# EAGLE design M710H (EAGLE 6.6.0)
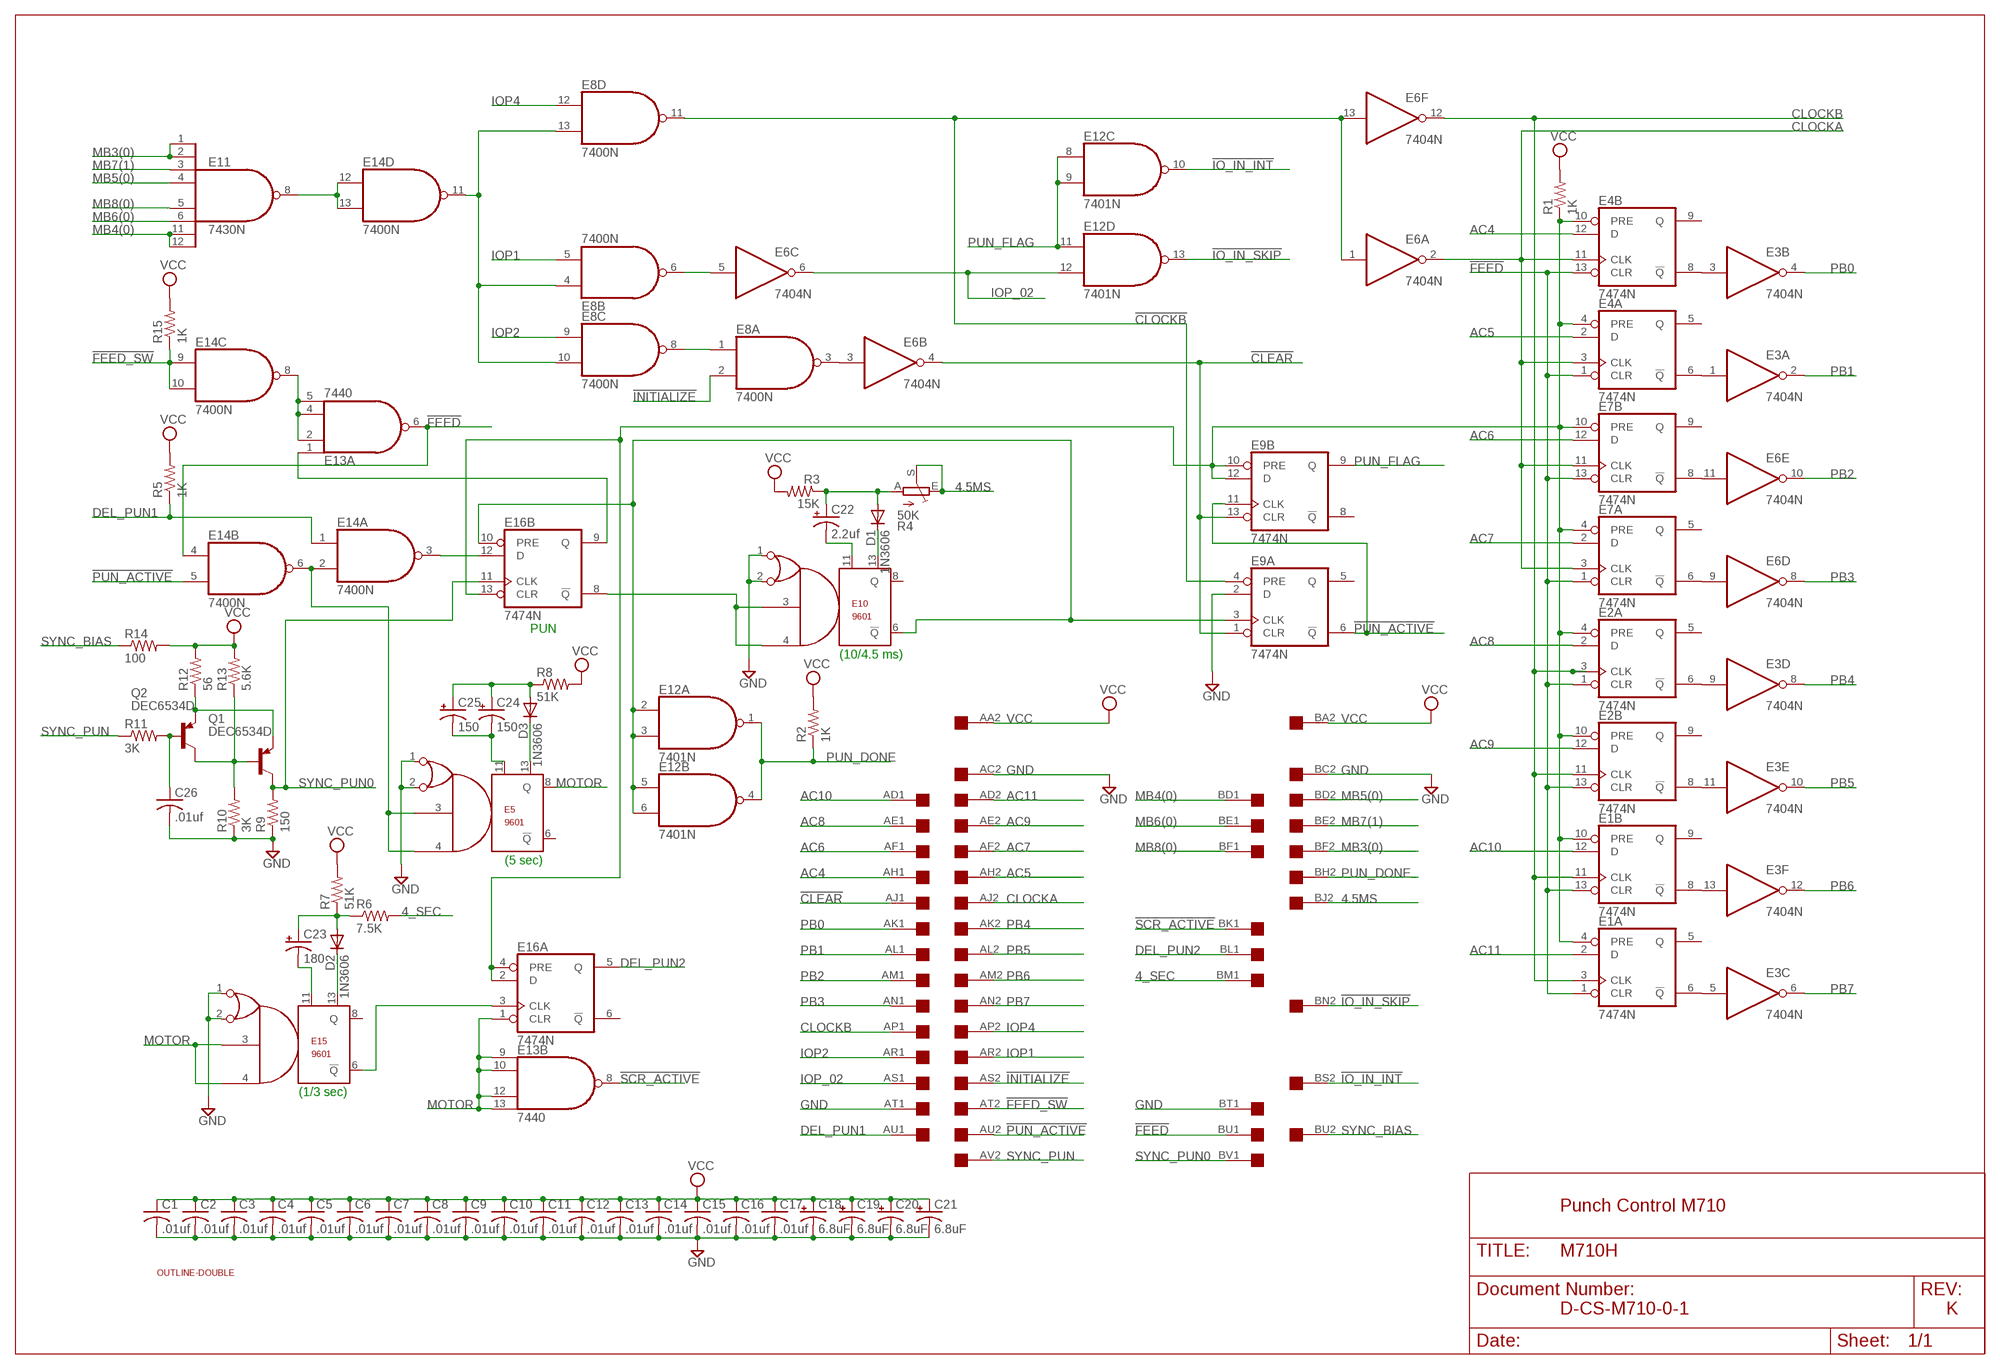
[diagram p0: schematic, sheet 1]

## Parts
C1  .01uf  C-US050-025X075  [C050-025X075]
C2  .01uf  C-US050-025X075  [C050-025X075]
C3  .01uf  C-US050-025X075  [C050-025X075]
C4  .01uf  C-US050-025X075  [C050-025X075]
C5  .01uf  C-US050-025X075  [C050-025X075]
C6  .01uf  C-US050-025X075  [C050-025X075]
C7  .01uf  C-US050-025X075  [C050-025X075]
C8  .01uf  C-US050-025X075  [C050-025X075]
C9  .01uf  C-US050-025X075  [C050-025X075]
C10  .01uf  C-US050-025X075  [C050-025X075]
C11  .01uf  C-US050-025X075  [C050-025X075]
C12  .01uf  C-US050-025X075  [C050-025X075]
C13  .01uf  C-US050-025X075  [C050-025X075]
C14  .01uf  C-US050-025X075  [C050-025X075]
C15  .01uf  C-US050-025X075  [C050-025X075]
C16  .01uf  C-US050-025X075  [C050-025X075]
C17  .01uf  C-US050-025X075  [C050-025X075]
C18  6.8uF  CPOL-USE20-8AXIAL  [E12-8]
C19  6.8uF  CPOL-USE20-8AXIAL  [E12-8]
C20  6.8uF  CPOL-USE20-8AXIAL  [E12-8]
C21  6.8uF  CPOL-USE20-8AXIAL  [E12-8]
C22  2.2uf  CPOL-USE15-5AXIAL  [E15-5]
C23  180  CPOL-USE20-8AXIAL  [E12-8]
C24  150  CPOL-USE22-6AXIAL  [E22-6]
C25  150  CPOL-USE22-6AXIAL  [E22-6]
C26  .01uf  C-US050-025X075  [C050-025X075]
D1  1N3606  1N4004  [DO41-10]
D2  1N3606  1N4004  [DO41-10]
D3  1N3606  1N4004  [DO41-10]
E1  7474N  74S74N  [DIL14]
E2  7474N  74S74N  [DIL14]
E3  7404N  [DIL14]
E4  7474N  74S74N  [DIL14]
E5  9601  [DIL14]
E6  7404N  [DIL14]
E7  7474N  74S74N  [DIL14]
E8  7400N  [DIL14]
E9  7474N  74S74N  [DIL14]
E10  9601  [DIL14]
E11  7430N  [DIL14]
E12  7401N  74LS01N  [DIL14]
E13  7440  74S20N  [DIL14]
E14  7400N  [DIL14]
E15  9601  [DIL14]
E16  7474N  74S74N  [DIL14]
Q1  DEC6534D  2N2905  [TO5]
Q2  DEC6534D  2N2905  [TO5]
R1  1K  R-US_0207/10  [0207/10]
R2  1K  R-US_0207/10  [0207/10]
R3  15K  R-US_0207/10  [0207/10]
R4  50K  TRIM_EU-RJ6  [RJ6]
R5  1K  R-US_0207/10  [0207/10]
R6  7.5K  R-US_0207/10  [0207/10]
R7  51K  R-US_0207/10  [0207/10]
R8  51K  R-US_0207/10  [0207/10]
R9  150  R-US_0207/10  [0207/10]
R10  3K  R-US_0207/10  [0207/10]
R11  3K  R-US_0207/10  [0207/10]
R12  56  R-US_0207/10  [0207/10]
R13  5.6K  R-US_0207/10  [0207/10]
R14  100  R-US_0207/10  [0207/10]
R15  1K  R-US_0207/10  [0207/10]
U$1  OUTLINE-DOUBLE  [DOUBLE]
U$2  DOUBLE  [EDGE-CON4]

## Nets
4.5MS: R4.E R4.S U$2.BJ2
4_SEC: R6.2 U$2.BM1
!CLEAR: E6.4(B:O) E9.1(A:CLR) E9.13(B:CLR) U$2.AJ1
!CLOCKB: E6.1(A:I) E6.13(F:I) E8.11(D:O) E9.4(A:PRE)
!FEED: E1.1(A:CLR) E1.13(B:CLR) E2.1(A:CLR) E2.13(B:CLR) E4.1(A:CLR) E4.13(B:CLR) E7.1(A:CLR) E7.13(B:CLR) E13.6(A:O) E14.4(B:I0) U$2.BU1
!FEED_SW: E14.9(C:I0) E14.10(C:I1) R15.1 U$2.AT2
!INITIALIZE: E8.2(A:I1) U$2.AS2
!IO_IN_INT: E12.10(C:O) U$2.BS2
!IO_IN_SKIP: E12.13(D:O) U$2.BN2
!PUN_ACTIVE: E9.6(A:!Q) E9.11(B:CLK) E14.5(B:I1) U$2.AU2
!SCR_ACTIVE: E13.8(B:O) U$2.BK1
AC4: E4.12(B:D) U$2.AH1
AC5: E4.2(A:D) U$2.AH2
AC6: E7.12(B:D) U$2.AF1
AC7: E7.2(A:D) U$2.AF2
AC8: E2.2(A:D) U$2.AE1
AC9: E2.12(B:D) U$2.AE2
AC10: E1.12(B:D) U$2.AD1
AC11: E1.2(A:D) U$2.AD2
CLOCKA: E4.3(A:CLK) E4.11(B:CLK) E6.2(A:O) E7.3(A:CLK) E7.11(B:CLK) U$2.AJ2
CLOCKB: E1.3(A:CLK) E1.11(B:CLK) E2.3(A:CLK) E2.11(B:CLK) E6.12(F:O) U$2.AP1
DEL_PUN1: E14.1(A:I0) R5.1 U$2.AU1
DEL_PUN2: E16.5(A:Q) U$2.BL1
GND: C1.2 C2.2 C3.2 C4.2 C5.2 C6.2 C7.2 C8.2 C9.2 C10.2 C11.2 C12.2 C13.2 C14.2 C15.2 C16.2 C17.2 C18.- C19.- C20.- C21.- C26.2 E5.1 E5.2 E9.2(A:D) E10.1 E10.2 E15.1 E15.2 R9.1 R10.1 U$2.AC2 U$2.AT1 U$2.BC2 U$2.BT1
IOP1: E8.5(B:I1) U$2.AR2
IOP2: E8.9(C:I0) U$2.AR1
IOP4: E8.12(D:I0) U$2.AP2
IOP_02: E6.6(C:O) E12.12(D:I1) U$2.AS1
MB3(0): E11.1(I0) E11.2(I1) U$2.BF2
MB4(0): E11.11(I6) E11.12(I7) U$2.BD1
MB5(0): E11.4(I3) U$2.BD2
MB6(0): E11.6(I5) U$2.BE1
MB7(1): E11.3(I2) U$2.BE2
MB8(0): E11.5(I4) U$2.BF1
MOTOR: E5.8(Q) E13.9(B:I0) E13.10(B:I1) E13.12(B:I2) E13.13(B:I3) E15.3 E15.4 E16.1(A:CLR)
N$1: E5.3 E5.4 E14.2(A:I1) E14.6(B:O)
N$2: E3.3(B:I) E4.8(B:!Q)
N$3: E3.1(A:I) E4.6(A:!Q)
N$4: E10.3 E10.4 E16.8(B:!Q)
N$5: E11.8(O) E14.12(D:I0) E14.13(D:I1)
N$6: E6.3(B:I) E8.3(A:O)
N$7: E8.1(A:I0) E8.8(C:O)
N$8: E8.4(B:I0) E8.10(C:I1) E8.13(D:I1) E14.11(D:O)
N$9: E2.6(A:!Q) E3.9(D:I)
N$10: E2.8(B:!Q) E3.11(E:I)
N$11: E1.8(B:!Q) E3.13(F:I)
N$12: E1.6(A:!Q) E3.5(C:I)
N$13: E6.11(E:I) E7.8(B:!Q)
N$14: E6.9(D:I) E7.6(A:!Q)
N$15: E9.3(A:CLK) E10.6(!Q) E12.2(A:I0) E12.3(A:I1) E12.5(B:I0) E12.6(B:I1) E16.10(B:PRE)
N$16: E6.5(C:I) E8.6(B:O)
N$19: Q1.2(B) Q2.3(C) R10.2 R13.1
N$26: E1.4(A:PRE) E1.10(B:PRE) E2.4(A:PRE) E2.10(B:PRE) E4.4(A:PRE) E4.10(B:PRE) E7.4(A:PRE) E7.10(B:PRE) E9.10(B:PRE) E9.12(B:D) E16.2(A:D) E16.4(A:PRE) E16.13(B:CLR) R1.1
N$36: Q1.1(E) Q2.1(E) R12.1
N$38: C26.1 Q2.2(B) R11.2
N$40: C23.- E15.11
N$41: E13.2(A:I1) E13.4(A:I2) E13.5(A:I3) E14.8(C:O)
N$49: C22.- E10.11
N$53: E13.1(A:I0) E16.9(B:Q)
N$54: E14.3(A:O) E16.12(B:D)
N$56: C24.- C25.- E5.11
N$57: D3.C E5.13
N$58: C24.+ C25.+ D3.A R8.1
N$59: D2.C E15.13
N$60: C23.+ D2.A R6.1 R7.1
N$61: E15.6(!Q) E16.3(A:CLK)
N$63: D1.C E10.13
N$64: C22.+ D1.A R3.1 R4.A
PB0: E3.4(B:O) U$2.AK1
PB1: E3.2(A:O) U$2.AL1
PB2: E6.10(E:O) U$2.AM1
PB3: E6.8(D:O) U$2.AN1
PB4: E3.8(D:O) U$2.AK2
PB5: E3.10(E:O) U$2.AL2
PB6: E3.12(F:O) U$2.AM2
PB7: E3.6(C:O) U$2.AN2
PUN_DONE: E12.1(A:O) E12.4(B:O) R2.1 U$2.BH2
PUN_FLAG: E9.9(B:Q) E12.8(C:I0) E12.9(C:I1) E12.11(D:I0)
SYNC_BIAS: R14.1 U$2.BU2
SYNC_PUN: R11.1 U$2.AV2
SYNC_PUN0: E16.11(B:CLK) Q1.3(C) R9.2 U$2.BV1
VCC: C1.1 C2.1 C3.1 C4.1 C5.1 C6.1 C7.1 C8.1 C9.1 C10.1 C11.1 C12.1 C13.1 C14.1 C15.1 C16.1 C17.1 C18.+ C19.+ C20.+ C21.+ R1.2 R2.2 R3.2 R5.2 R7.2 R8.2 R12.2 R13.2 R14.2 R15.2 U$2.AA2 U$2.BA2
Unconnected: E1.5(A:Q) E1.9(B:Q) E2.5(A:Q) E2.9(B:Q) E4.5(A:Q) E4.9(B:Q) E5.6(!Q) E7.5(A:Q) E7.9(B:Q) E9.5(A:Q) E9.8(B:!Q) E10.8(Q) E15.8(Q) E16.6(A:!Q) U$2.AA1 U$2.AB1 U$2.AB2 U$2.AC1 U$2.AV1 U$2.BA1 U$2.BB1 U$2.BB2 U$2.BC1 U$2.BH1 U$2.BJ1 U$2.BK2 U$2.BL2 U$2.BM2 U$2.BN1 U$2.BP1 U$2.BP2 U$2.BR1 U$2.BR2 U$2.BS1 U$2.BT2 U$2.BV2

## Notes on the sheet
- PUN
- (10/4.5 ms)
- (5 sec)
- (1/3 sec)
- Punch Control M710
- D-CS-M710-0-1 | K

## Power pins joined to a net without a drawn wire
GND: E1.7(P:GND) E2.7(P:GND) E3.7(P:GND) E4.7(P:GND) E5.7(GND) E6.7(P:GND) E7.7(P:GND) E8.7(P:GND) E9.7(P:GND) E10.7(GND) E11.7(GND) E12.7(P:GND) E13.7(P:GND) E14.7(P:GND) E15.7(GND) E16.7(P:GND)
VCC: E1.14(P:VCC) E2.14(P:VCC) E3.14(P:VCC) E4.14(P:VCC) E5.14(VCC) E6.14(P:VCC) E7.14(P:VCC) E8.14(P:VCC) E9.14(P:VCC) E10.14(VCC) E11.14(VCC) E12.14(P:VCC) E13.14(P:VCC) E14.14(P:VCC) E15.14(VCC) E16.14(P:VCC)

## Library data of the parts
C1-C17 C26 = rcl:C-US: CAPACITOR, American symbol
C18-C21 C23 = dec-con:CPOL-USE20-8AXIAL: A 0.8 inch electrolytic.
C22 C24 C25 = rcl:CPOL-US: POLARIZED CAPACITOR, American symbol
D1-D3 = diode:1N4004: DIODE general purpose rectifier, 1 A
E1 E2 E4 E7 E9 E16 = 74xx-us:74*74: Dual D type positive edge triggered FLIP FLOP, preset and clear
E3 E6 = 74xx-us:74*04: Hex INVERTER
E5 E10 E15 = dec-con:9601: DEC9601 monstable
E8 E14 = 74xx-us:74*00: Quad 2-input NAND gate
E11 = 74xx-us:74*30: 8-input NAND gate
E12 = 74xx-us:74*01: Quad 2-input NAND gate, open collector
E13 = 74xx-us:74*20: Dual 4-input NAND gate
Q1 Q2 = transistor-pnp:2N2905: PNP Transistor
R1-R3 R5-R15 = rcl:R-US_: RESISTOR, American symbol
R4 = pot:TRIM_EU-: POTENTIOMETER
U$1 = dec-con:OUTLINE-*: Board outlines for DEC boards.
U$2 = dec-con:DOUBLE: Double-Height DEC board

## Board
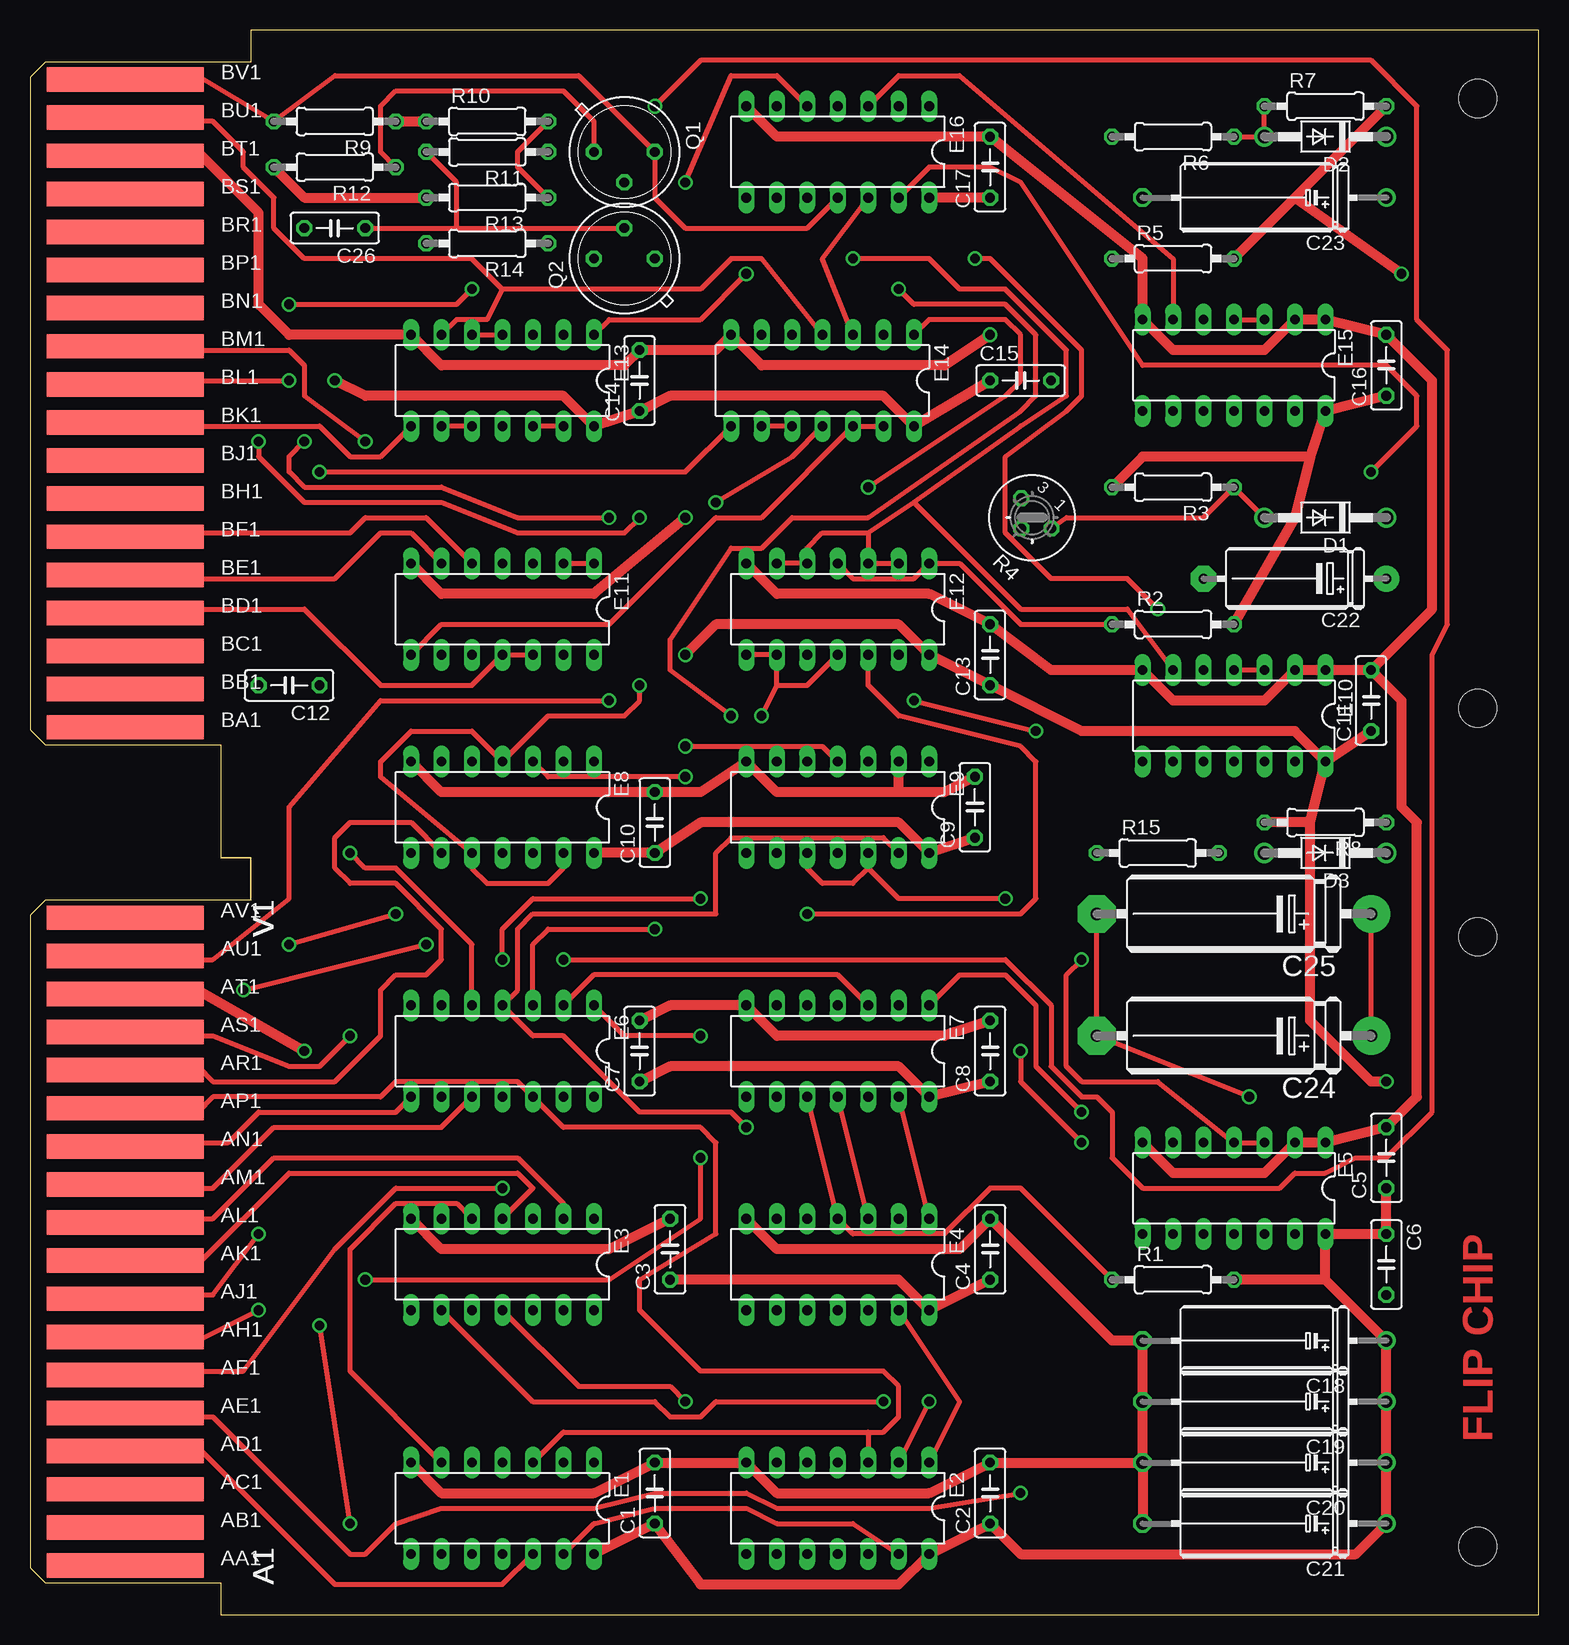
[diagram p1: board, top side]
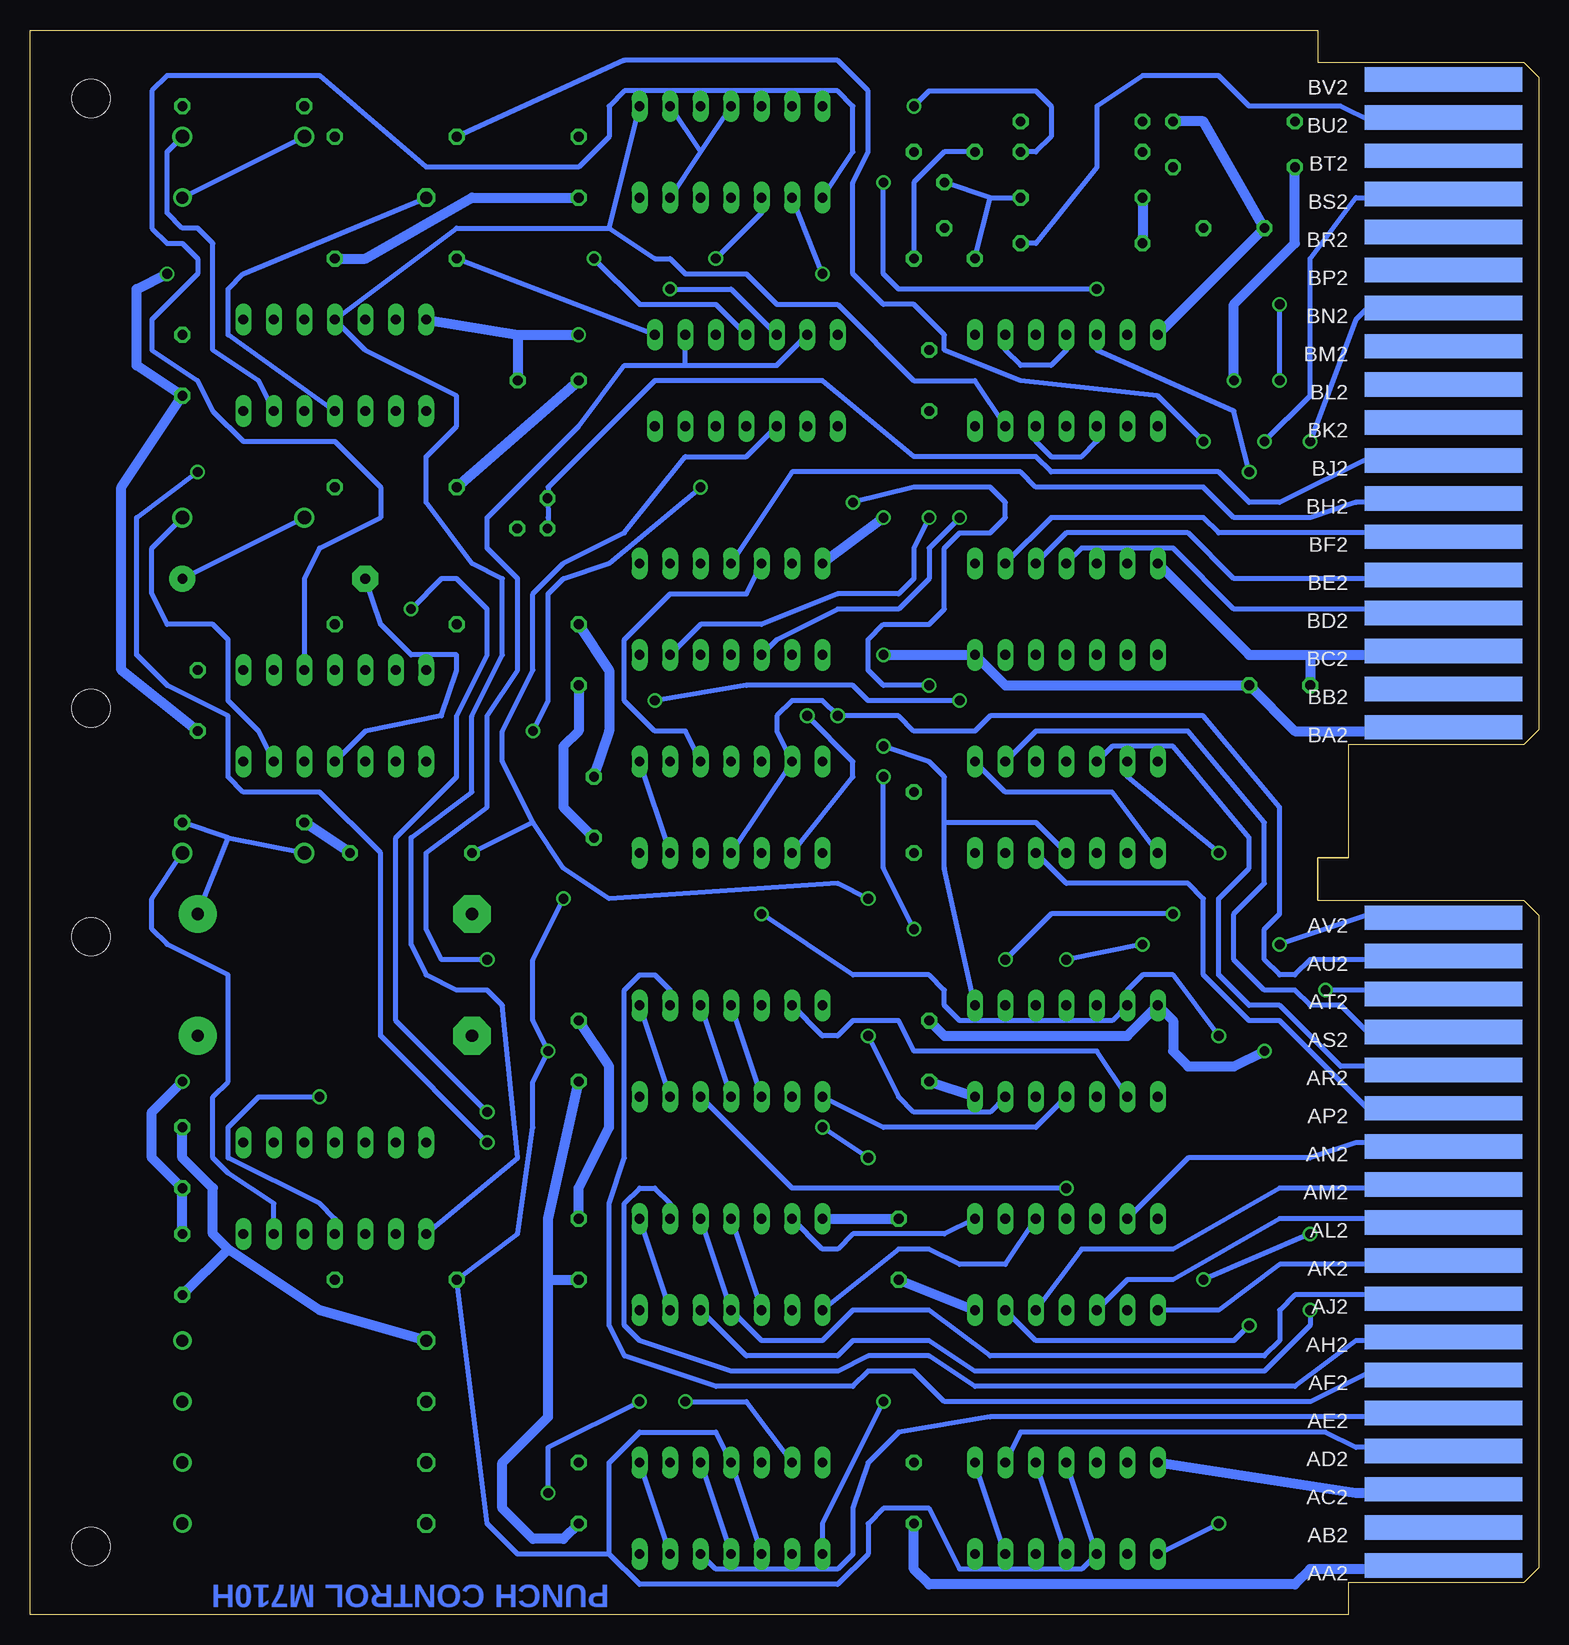
[diagram p2: board, bottom side, seen from below]

Size 125.73 x 132.08 mm. Coordinates in mm from the lower left corner, seen from the top.
Copper layers (1+16): Top 0.035mm / dielectric 1.5mm / Bottom 0.035mm
Design rules "16mils": minimum track width 16mil, minimum drill 32mil, track to track 15mil, track to pad 10mil, pad to pad 10mil, via to via 10mil, smd to smd 10mil, copper to edge 13mil, drill to drill 10mil, minimum pad ring 10mil, minimum via ring 8mil, stop-mask expansion 0mil, vias tented up to drill 0mil, thermal gap 10mil
vRestrict: area 31.8,108 to 41.9,125.7; area 49.5,108 to 59.7,125.7; area 67.3,108 to 77.5,125.7; area 85.1,108 to 95.3,125.7; area 102.9,108 to 113,125.7; area 31.8,80 to 41.9,97.8; area 49.5,80 to 59.7,97.8; area 67.3,80 to 77.5,97.8; area 85.1,80 to 95.3,97.8; area 31.8,34.3 to 41.9,52.1; area 49.5,34.3 to 59.7,52.1; area 67.3,34.3 to 77.5,52.1; area 85.1,34.3 to 95.3,52.1; area 102.9,11.4 to 113,29.2; area 85.1,11.4 to 95.3,29.2; area 49.5,11.4 to 59.7,29.2; area 31.8,11.4 to 41.9,29.2; area 67.3,11.4 to 77.5,29.2

### Footprints (pad centres in the part's own frame; a part is rotated, then mirrored left to right if it is on the bottom)
C050-025X075 = drill 0.813 octagon: 1 -2.54,0; 2 2.54,0
E12-8 = drill 1.016: + -10.16,0 | drill 1.016 octagon: - 10.16,0
E15-5 = drill 0.813 pad 2.159: + -7.62,0 | drill 0.813 pad 2.159 octagon: - 7.62,0
E22-6 = drill 1.016 pad 3.15: + -11.43,0 | drill 1.016 pad 3.15 octagon: - 11.43,0
DO41-10 = drill 1.118: A 5.08,0; C -5.08,0
DIL14 = drill 0.813 long: 1 -7.62,-3.81; 2 -5.08,-3.81; 3 -2.54,-3.81; 4 0,-3.81; 5 2.54,-3.81; 6 5.08,-3.81; 7 7.62,-3.81; 8 7.62,3.81; 9 5.08,3.81; 10 2.54,3.81; 11 0,3.81; 12 -2.54,3.81; 13 -5.08,3.81; 14 -7.62,3.81
TO5 = drill 0.813 octagon: 1 0,-2.54; 2 2.54,0; 3 0,2.54
0207/10 = drill 0.813 octagon: 1 -5.08,0; 2 5.08,0
RJ6 = drill 0.813 octagon: A -1.778,-0.508; E 1.778,-0.508; S 0,1.27
DOUBLE = hole 3.175: 120.65,56.515; 120.65,5.715; 120.65,75.565; 120.65,126.365
EDGE-CON4 = smd 13.106 x 2.032: AA1 7.938,4.128; AB1 7.938,7.303; AC1 7.938,10.477; AD1 7.938,13.652; AE1 7.938,16.828; AF1 7.938,20.003; AH1 7.938,23.177; AJ1 7.938,26.352; AK1 7.938,29.527; AL1 7.938,32.703; AM1 7.938,35.877; AN1 7.938,39.053; AP1 7.938,42.227; AR1 7.938,45.403; AS1 7.938,48.578; AT1 7.938,51.752; AU1 7.938,54.928; AV1 7.938,58.102; BA1 7.938,73.978; BB1 7.938,77.153; BC1 7.938,80.328; BD1 7.938,83.502; BE1 7.938,86.677; BF1 7.938,89.853; BH1 7.938,93.028; BJ1 7.938,96.203; BK1 7.938,99.377; BL1 7.938,102.552; BM1 7.938,105.728; BN1 7.938,108.903; BP1 7.938,112.078; BR1 7.938,115.252; BS1 7.938,118.427; BT1 7.938,121.603; BU1 7.938,124.778; BV1 7.938,127.953 | smd 13.106 x 2.032 bottom: AA2 7.938,4.128; AB2 7.938,7.303; AC2 7.938,10.477; AD2 7.938,13.652; AE2 7.938,16.828; AF2 7.938,20.003; AH2 7.938,23.177; AJ2 7.938,26.352; AK2 7.938,29.527; AL2 7.938,32.703; AM2 7.938,35.877; AN2 7.938,39.053; AP2 7.938,42.227; AR2 7.938,45.403; AS2 7.938,48.578; AT2 7.938,51.752; AU2 7.938,54.928; AV2 7.938,58.102; BA2 7.938,73.978; BB2 7.938,77.153; BC2 7.938,80.328; BD2 7.938,83.502; BE2 7.938,86.677; BF2 7.938,89.853; BH2 7.938,93.028; BJ2 7.938,96.203; BK2 7.938,99.377; BL2 7.938,102.552; BM2 7.938,105.728; BN2 7.938,108.903; BP2 7.938,112.078; BR2 7.938,115.252; BS2 7.938,118.427; BT2 7.938,121.603; BU2 7.938,124.778; BV2 7.938,127.953

### Placement (x,y rotation side)
C1  52.07,10.16 90 top
C2  80.01,10.16 90 top
C3  53.34,30.48 90 top
C4  80.01,30.48 90 top
C5  113.03,38.1 90 top
C6  113.03,29.21 270 top
C7  50.8,46.99 90 top
C8  80.01,46.99 90 top
C9  78.74,67.31 90 top
C10  52.07,66.04 90 top
C11  111.76,76.2 90 top
C12  21.59,77.47 180 top
C13  80.01,80.01 90 top
C14  50.8,102.87 90 top
C15  82.55,102.87 0 top
C16  113.03,104.14 90 top
C17  80.01,120.65 90 top
C18  102.87,22.86 180 top
C19  102.87,17.78 180 top
C20  102.87,12.7 180 top
C21  102.87,7.62 180 top
C22  105.41,86.36 180 top
C23  102.87,118.11 180 top
C24  100.33,48.26 180 top
C25  100.33,58.42 180 top
C26  25.4,115.57 180 top
D1  107.95,91.44 180 top
D2  107.95,123.19 180 top
D3  107.95,63.5 180 top
E1  39.37,8.89 180 top
E2  67.31,8.89 180 top
E3  39.37,29.21 180 top
E4  67.31,29.21 180 top
E5  100.33,35.56 180 top
E6  39.37,46.99 180 top
E7  67.31,46.99 180 top
E8  39.37,67.31 180 top
E9  67.31,67.31 180 top
E10  100.33,74.93 180 top
E11  39.37,83.82 180 top
E12  67.31,83.82 180 top
E13  39.37,102.87 180 top
E14  66.04,102.87 180 top
E15  100.33,104.14 180 top
E16  67.31,121.92 180 top
Q1  49.53,121.92 270 top
Q2  49.53,113.03 90 top
R1  95.25,27.94 0 top
R2  95.25,82.55 0 top
R3  95.25,93.98 180 top
R4  83.5,91.44 135 top
R5  95.25,113.03 0 top
R6  95.25,123.19 180 top
R7  107.95,125.73 0 top
R8  107.95,66.04 180 top
R9  25.4,124.46 180 top
R10  38.1,124.46 0 top
R11  38.1,121.92 180 top
R12  25.4,120.65 180 top
R13  38.1,118.11 180 top
R14  38.1,114.3 180 top
R15  93.98,63.5 0 top
U$1  0,0 0 top
U$2  0,0 0 top
U$3  [FLIPCHIP]  124.46,50.8 180 top

### Tracks (layer width: path | path; a pad name or v marks a point on that pad's centre or on a via)
4.5MS
  Bottom 0.406: U$2.BJ2 8.89,96.52 13.97,96.52 21.59,92.71 24.13,92.71 26.67,95.25 40.64,95.25 41.91,96.52 52.07,96.52 59.69,102.87 73.66,102.87 82.55,93.98 R4.E 82.55,91.44 R4.S
4_SEC  (via drill 0.81)
  Top 0.406: U$2.BM1 8.89,105.41 21.59,105.41 22.86,104.14 22.86,101.6 v27.94,97.79
  Bottom 0.406: v27.94,97.79 31.75,101.6 43.18,102.87 49.53,105.41 49.53,106.68 52.07,109.22 54.61,109.22 57.15,111.76 57.15,119.38 55.88,121.92 55.88,127 58.42,129.54 76.2,129.54 R6.2
!CLEAR  (via drill 0.81)
  Top 0.406: U$2.AJ1 8.89,26.67 15.24,26.67 v19.05,31.75 | v27.94,27.94 48.26,27.94 55.88,33.02 v55.88,38.1 | v59.69,40.64 58.42,41.91 50.8,41.91 44.45,48.26 41.91,48.26 E6.4 40.64,52.07 40.64,57.15 41.91,58.42 57.15,58.42 57.15,63.5 58.42,64.77 71.12,64.77 E9.13
  Bottom 0.406: E9.13 E9.1 | v19.05,31.75 v27.94,27.94 | v55.88,38.1 v59.69,40.64
!CLOCKB  (via drill 0.81)
  Top 0.406: v54.61,72.39 66.04,72.39 E9.4 | E6.1 49.53,48.26 v55.88,48.26
  Bottom 0.406: E8.11 41.91,66.04 49.53,66.04 | 49.53,66.04 49.53,62.23 E6.1 | 49.53,66.04 49.53,69.85 50.8,71.12 v54.61,72.39 | E6.13 45.72,41.91 52.07,41.91 53.34,43.18 v55.88,48.26
!FEED  (via drill 0.81)
  Top 0.406: E4.1 E7.13 | E2.1 77.47,17.78 E4.13 | U$2.BU1 8.89,124.46 15.24,124.46 17.78,121.92 17.78,120.65 20.32,118.11 20.32,115.57 22.86,113.03 36.83,113.03 39.37,110.49 | E13.6 35.56,107.95 38.1,107.95 39.37,110.49 | 39.37,110.49 55.88,110.49 58.42,113.03 60.96,113.03 E14.4 | E7.1 77.47,53.34 81.28,53.34 83.82,50.8 83.82,45.72 v87.63,41.91 | v93.98,83.82 91.44,86.36 85.09,86.36 81.28,90.17 81.28,96.52 86.36,100.33 87.63,101.6 87.63,105.41 80.01,113.03 v78.74,113.03 | E2.13 68.58,7.62 62.23,7.62 59.69,8.89 52.07,8.89 46.99,7.62 E1.13
  Bottom 0.406: E1.13 E1.1 | E2.13 E2.1 | E4.13 E4.1 | E7.13 E7.1 | E14.4 68.58,109.22 74.93,109.22 v78.74,113.03 | v93.98,83.82 91.44,86.36 90.17,86.36 87.63,83.82 87.63,80.01 90.17,74.93 90.17,69.85 95.25,64.77 95.25,49.53 v87.63,41.91
!FEED_SW  (via drill 0.81)
  Top 0.406: E14.10 E14.9 | v17.78,52.07 v33.02,55.88 | v39.37,54.61 39.37,57.15 41.91,59.69 v55.88,59.69
  Bottom 0.406: U$2.AT2 8.89,52.07 v17.78,52.07 | E14.10 66.04,96.52 71.12,96.52 76.2,90.17 81.28,87.63 83.82,85.09 83.82,78.74 86.36,73.66 86.36,71.12 83.82,66.04 | 83.82,66.04 R15.1 | 83.82,66.04 81.28,62.23 77.47,59.69 58.42,60.96 v55.88,59.69 | v33.02,55.88 v39.37,54.61
!INITIALIZE
  Bottom 0.406: U$2.AS2 8.89,48.26 13.97,48.26 16.51,50.8 19.05,50.8 20.32,52.07 22.86,52.07 25.4,54.61 25.4,58.42 22.86,60.96 22.86,66.04 29.21,73.66 41.91,73.66 E8.2
!IO_IN_INT  (via drill 0.81)
  Top 0.406: v22.86,97.79 21.59,96.52 21.59,95.25 22.86,93.98 34.29,93.98 40.64,91.44 v48.26,91.44
  Bottom 0.406: E12.10 63.5,81.28 58.42,83.82 53.34,83.82 50.8,86.36 50.8,88.9 v48.26,91.44 | U$2.BS2 8.89,118.11 15.24,118.11 19.05,113.03 19.05,101.6 v22.86,97.79
!IO_IN_SKIP  (via drill 0.81)
  Top 0.406: v19.05,97.79 19.05,96.52 22.86,92.71 34.29,92.71 40.64,90.17 49.53,90.17 v50.8,91.44
  Bottom 0.406: E12.13 69.85,82.55 64.77,82.55 58.42,85.09 53.34,85.09 52.07,86.36 52.07,88.9 v50.8,91.44 | U$2.BN2 8.89,109.22 13.97,109.22 15.24,107.95 v19.05,97.79
!PUN_ACTIVE  (via drill 0.81)
  Top 0.406: v72.39,110.49 73.66,109.22 81.28,109.22 83.82,106.68 83.82,101.6 82.55,100.33 69.85,91.44 63.5,91.44 60.96,88.9 58.42,88.9 53.34,81.28 53.34,78.74 v58.42,74.93
  Bottom 0.406: U$2.AU2 8.89,54.61 19.05,54.61 20.32,53.34 21.59,53.34 22.86,54.61 22.86,57.15 21.59,58.42 21.59,67.31 27.94,74.93 45.72,74.93 46.99,73.66 52.07,73.66 53.34,74.93 v58.42,74.93 59.69,76.2 62.23,76.2 63.5,74.93 63.5,73.66 E9.6 E9.11 | E14.5 67.31,110.49 v72.39,110.49
!SCR_ACTIVE
  Top 0.406: U$2.BK1 8.89,99.06 24.13,99.06 26.67,96.52 29.21,96.52 E13.8
AC4  (via drill 0.81)
  Top 0.406: U$2.AH1 8.89,22.86 13.97,22.86 v19.05,25.4
  Bottom 0.406: v19.05,25.4 19.05,24.13 22.86,20.32 46.99,20.32 50.8,22.86 57.15,22.86 58.42,21.59 66.04,21.59 E4.12
AC5
  Bottom 0.406: U$2.AH2 8.89,22.86 15.24,22.86 20.32,19.05 46.99,19.05 50.8,21.59 55.88,21.59 58.42,20.32 67.31,20.32 74.93,22.86 76.2,24.13 76.2,34.29 74.93,35.56 73.66,35.56 72.39,34.29 E4.2
AC6  (via drill 0.81)
  Top 0.406: U$2.AF1 8.89,20.32 17.78,20.32 25.4,30.48 30.48,35.56 v39.37,35.56
  Bottom 0.406: E7.12 62.23,35.56 v39.37,35.56
AC7
  Bottom 0.406: U$2.AF2 8.89,20.32 13.97,20.32 19.05,17.78 49.53,17.78 52.07,20.32 55.88,20.32 57.15,19.05 68.58,19.05 76.2,21.59 77.47,24.13 77.47,34.29 76.2,38.1 76.2,52.07 74.93,53.34 73.66,53.34 72.39,52.07 E7.2
AC8  (via drill 0.81)
  Top 0.406: v74.93,17.78 E2.2 | U$2.AE1 8.89,16.51 15.24,16.51 26.67,5.08 27.94,5.08 30.48,7.62 34.29,8.89 46.99,8.89 52.07,10.16 59.69,10.16 62.23,8.89 74.93,8.89 v82.55,10.16
  Bottom 0.406: v74.93,17.78 82.55,13.97 v82.55,10.16
AC9
  Bottom 0.406: U$2.AE2 8.89,16.51 45.72,16.51 53.34,15.24 55.88,12.7 57.15,8.89 57.15,5.08 58.42,3.81 68.58,3.81 E2.12
AC10
  Top 0.406: E1.12 39.37,2.54 25.4,2.54 13.97,13.97 8.89,13.97 U$2.AD1
AC11
  Bottom 0.406: U$2.AD2 8.89,13.97 15.24,13.97 17.78,15.24 43.18,15.24 E1.2
CLOCKA
  Top 0.406: E4.3 E7.11 | E6.2 46.99,53.34 67.31,53.34 E7.3
  Bottom 0.406: U$2.AJ2 8.89,26.67 20.32,26.67 21.59,25.4 21.59,22.86 22.86,21.59 45.72,21.59 50.8,25.4 57.15,25.4 59.69,22.86 64.77,22.86 E4.11 E4.3 | E7.11 E7.3
CLOCKB
  Top 0.406: U$2.AP1 8.89,41.91 13.97,41.91 15.24,43.18 29.21,43.18 30.48,44.45 40.64,44.45 E6.12 44.45,40.64 55.88,40.64 57.15,39.37 57.15,31.75 50.8,27.94 50.8,25.4 55.88,20.32 71.12,20.32 72.39,19.05 72.39,16.51 71.12,15.24 69.85,15.24 | E1.3 44.45,15.24 69.85,15.24 | 69.85,15.24 E2.3
  Bottom 0.406: E1.11 E1.3 | E2.3 E2.11
DEL_PUN1  (via drill 0.81)
  Top 0.406: U$2.AU1 8.89,54.61 15.24,54.61 21.59,59.69 21.59,67.31 29.21,76.2 v48.26,76.2 | v69.85,93.98 81.28,101.6 82.55,102.87 82.55,106.68 81.28,107.95 74.93,107.95 E14.1 | v73.66,76.2 v83.82,73.66
  Bottom 0.406: E14.1 R5.1 | v48.26,76.2 55.88,76.2 57.15,77.47 66.04,77.47 v73.66,76.2 | v69.85,93.98 77.47,87.63 81.28,86.36 82.55,85.09 82.55,76.2 v83.82,73.66
DEL_PUN2  (via drill 0.81)
  Top 0.406: U$2.BL1 8.89,102.87 v21.59,102.87 | v21.59,109.22 35.56,109.22 v36.83,110.49 | E16.5 62.23,128.27 58.42,128.27 v54.61,119.38
  Bottom 0.406: v21.59,102.87 v21.59,109.22 | v36.83,110.49 53.34,110.49 54.61,111.76 v54.61,119.38
GND  (via drill 0.81)
  Top 0.813: R9.1 R10.1 | C20.- C19.- C18.- 90.17,22.86 C4.2 77.47,30.48 62.23,30.48 E4.7 | C20.- C21.- | C20.- C2.2 74.93,10.16 62.23,10.16 E2.7 C1.2 46.99,10.16 34.29,10.16 E1.7 | U$2.BT1 8.89,121.92 13.97,121.92 19.05,116.84 19.05,109.22 21.59,106.68 E13.7 34.29,104.14 49.53,104.14 C14.2 57.15,105.41 E14.7 60.96,104.14 76.2,104.14 v80.01,106.68 | E16.7 62.23,123.19 C17.2 92.71,113.03 E15.7 95.25,105.41 102.87,105.41 E15.2 E15.1 C16.2 116.84,102.87 116.84,83.82 C11.2 | C11.2 E10.1 E10.2 102.87,76.2 95.25,76.2 E10.7 85.09,78.74 C13.2 74.93,85.09 62.23,85.09 E12.7 | C8.2 76.2,48.26 62.23,48.26 E7.7 53.34,50.8 C7.2 | E8.7 34.29,68.58 C10.2 55.88,68.58 E9.7 62.23,68.58 72.39,68.58 | 72.39,68.58 76.2,68.58 C9.2 | 72.39,68.58 E9.2 | v54.61,91.44 46.99,85.09 34.29,85.09 E11.7 | E3.7 34.29,30.48 48.26,30.48 C3.2 | U$2.AT1 8.89,52.07 13.97,52.07 v22.86,46.99 | C11.2 114.3,76.2 114.3,67.31 115.57,66.04 115.57,43.18 C5.2 E5.1 E5.2 102.87,36.83 95.25,36.83 E5.7
  Bottom 0.813: R9.1 27.94,124.46 C26.2 E13.7 | U$2.AC2 8.89,10.16 15.24,10.16 E1.7 | E4.7 C3.2 | v22.86,46.99 25.4,45.72 29.21,45.72 30.48,46.99 30.48,49.53 E6.7 34.29,48.26 49.53,48.26 C7.2 | U$2.BC2 8.89,80.01 19.05,80.01 | 19.05,80.01 C12.2 | E11.7 24.13,80.01 19.05,80.01 | E12.7 v54.61,91.44 | C4.2 80.01,35.56 77.47,40.64 77.47,45.72 C8.2 | C9.2 77.47,73.66 77.47,78.74 C13.2 | E15.7 85.09,106.68 | 85.09,106.68 C15.2 | 85.09,106.68 v80.01,106.68 | C18.- 101.6,25.4 109.22,30.48 | C5.2 113.03,38.1 110.49,35.56 110.49,31.75 109.22,30.48 | 109.22,30.48 C6.2
IOP1
  Bottom 0.406: U$2.AR2 8.89,45.72 16.51,45.72 21.59,50.8 24.13,50.8 26.67,53.34 26.67,59.69 24.13,62.23 24.13,64.77 30.48,72.39 35.56,72.39 E8.5
IOP2
  Top 0.406: U$2.AR1 8.89,45.72 13.97,45.72 15.24,44.45 25.4,44.45 29.21,48.26 29.21,52.07 30.48,53.34 33.02,53.34 34.29,54.61 34.29,57.15 30.48,60.96 26.67,60.96 25.4,62.23 25.4,64.77 26.67,66.04 31.75,66.04 E8.9
IOP4
  Bottom 0.406: U$2.AP2 8.89,41.91 13.97,41.91 21.59,49.53 24.13,49.53 27.94,53.34 27.94,59.69 29.21,60.96 39.37,60.96 E8.12
IOP_02  (via drill 0.81)
  Top 0.406: U$2.AS1 8.89,48.26 15.24,48.26 21.59,45.72 24.13,45.72 v26.67,48.26 | E12.12 69.85,77.47 72.39,74.93 82.55,72.39 83.82,71.12 83.82,59.69 82.55,58.42 v64.77,58.42
  Bottom 0.406: v26.67,48.26 30.48,53.34 33.02,53.34 34.29,52.07 E6.6 35.56,49.53 48.26,49.53 49.53,50.8 49.53,52.07 50.8,53.34 57.15,53.34 v64.77,58.42
MB3(0)
  Top 0.406: E11.2 E11.1
  Bottom 0.406: U$2.BF2 8.89,90.17 26.67,90.17 27.94,91.44 40.64,91.44 E11.2
MB4(0)
  Top 0.406: E11.12 E11.11 36.83,77.47 29.21,77.47 22.86,83.82 8.89,83.82 U$2.BD1
MB5(0)
  Bottom 0.406: U$2.BD2 8.89,83.82 25.4,83.82 30.48,88.9 38.1,88.9 E11.4
MB6(0)
  Top 0.406: U$2.BE1 8.89,86.36 25.4,86.36 29.21,90.17 31.75,90.17 E11.6
MB7(1)
  Bottom 0.406: U$2.BE2 8.89,86.36 25.4,86.36 29.21,90.17 39.37,90.17 E11.3
MB8(0)
  Top 0.406: U$2.BF1 8.89,90.17 26.67,90.17 27.94,91.44 33.02,91.44 E11.5
MOTOR
  Top 0.406: E13.13 E13.12 | E13.10 E13.9 | E15.4 E15.3
  Bottom 0.406: 77.47,115.57 E16.1 | 77.47,115.57 90.17,115.57 E15.4 97.79,105.41 90.17,101.6 90.17,99.06 92.71,96.52 92.71,92.71 88.9,87.63 86.36,86.36 86.36,80.01 88.9,74.93 88.9,68.58 93.98,64.77 93.98,55.88 92.71,53.34 90.17,52.07 87.63,52.07 86.36,50.8 85.09,38.1 E5.8 | 77.47,115.57 73.66,113.03 72.39,113.03 71.12,111.76 66.04,111.76 63.5,109.22 58.42,109.22 52.07,102.87 46.99,102.87 E13.13 | E13.12 41.91,97.79 40.64,96.52 38.1,96.52 36.83,97.79 E13.10
N$1  (via drill 0.81)
  Top 0.406: v87.63,54.61 86.36,53.34 86.36,45.72 87.63,44.45 93.98,44.45 E5.4 E5.3
  Bottom 0.406: E14.6 63.5,104.14 71.12,104.14 | 71.12,104.14 E14.2 | 71.12,104.14 76.2,104.14 80.01,99.06 87.63,91.44 87.63,88.9 85.09,86.36 85.09,78.74 87.63,74.93 87.63,67.31 92.71,63.5 92.71,57.15 91.44,54.61 v87.63,54.61
N$2
  Bottom 0.406: E3.3 44.45,29.21 48.26,29.21 50.8,30.48 53.34,30.48 E4.8
N$3
  Bottom 0.406: E4.6 59.69,30.48 58.42,30.48 57.15,31.75 49.53,31.75 E3.1
N$4
  Top 0.406: E10.3 E10.4
  Bottom 0.406: E10.3 102.87,86.36 101.6,88.9 96.52,91.44 96.52,93.98 100.33,97.79 107.95,97.79 110.49,100.33 111.76,102.87 115.57,105.41 115.57,107.95 111.76,111.76 111.76,113.03 113.03,114.3 114.3,114.3 115.57,115.57 115.57,127 114.3,128.27 101.6,128.27 92.71,120.65 80.01,120.65 77.47,123.19 77.47,125.73 76.2,127 58.42,127 57.15,125.73 57.15,121.92 E16.8
N$5
  Top 0.406: E14.13 E14.12 60.96,91.44 57.15,91.44 48.26,82.55 34.29,82.55 E11.8
N$6  (via drill 0.81)
  Top 0.406: E6.3 41.91,55.88 43.18,57.15 v52.07,57.15 | E8.3 43.18,69.85 v54.61,69.85
  Bottom 0.406: v54.61,69.85 54.61,62.23 v52.07,57.15
N$7
  Bottom 0.406: E8.8 35.56,68.58 44.45,68.58 E8.1
N$8  (via drill 0.81)
  Top 0.406: E8.13 44.45,62.23 43.18,60.96 38.1,60.96 36.83,62.23 E8.10 29.21,69.85 29.21,71.12 31.75,73.66 36.83,73.66 E8.4 43.18,74.93 49.53,74.93 50.8,76.2 v50.8,77.47 | E14.11 63.5,96.52 v57.15,92.71
  Bottom 0.406: v50.8,77.47 54.61,77.47 55.88,78.74 55.88,81.28 54.61,82.55 50.8,82.55 49.53,83.82 49.53,88.9 48.26,90.17 45.72,90.17 44.45,91.44 44.45,92.71 45.72,93.98 52.07,93.98 v57.15,92.71
N$9  (via drill 0.81)
  Top 0.406: E3.9 41.91,17.78 52.07,17.78 53.34,16.51 55.88,16.51 57.15,17.78 v71.12,17.78
  Bottom 0.406: E2.6 66.04,17.78 v71.12,17.78
N$10  (via drill 0.81)
  Top 0.406: E3.11 45.72,19.05 53.34,19.05 v54.61,17.78
  Bottom 0.406: E2.8 59.69,7.62 v54.61,17.78
N$11  (via drill 0.81)
  Top 0.406: v26.67,7.62 v24.13,24.13
  Bottom 0.406: v26.67,7.62 E1.8 | E3.13 41.91,22.86 25.4,22.86 v24.13,24.13
N$12
  Top 0.406: E1.6 26.67,20.32 26.67,30.48 30.48,34.29 35.56,34.29 E3.5
N$13
  Bottom 0.406: E6.11 41.91,40.64 54.61,40.64 E7.8
N$14
  Bottom 0.406: E6.9 36.83,46.99 52.07,46.99 53.34,49.53 57.15,49.53 58.42,48.26 59.69,48.26 E7.6
N$15  (via drill 0.81)
  Top 0.406: E12.6 E12.5 64.77,88.9 66.04,90.17 69.85,90.17 | 69.85,90.17 E12.3 E12.2 | 69.85,90.17 73.66,92.71 | E10.6 91.44,83.82 82.55,83.82 73.66,92.71 | 73.66,92.71 82.55,99.06 86.36,101.6 86.36,105.41 81.28,110.49 77.47,110.49 74.93,113.03 v68.58,113.03
  Bottom 0.406: E9.3 71.12,73.66 73.66,73.66 76.2,76.2 76.2,81.28 72.39,85.09 66.04,85.09 E12.5 | E16.10 64.77,116.84 v68.58,113.03
N$16  (via drill 0.81)
  Top 0.406: v26.67,63.5 27.94,62.23 30.48,62.23 36.83,55.88 E6.5
  Bottom 0.406: E8.6 34.29,69.85 v26.67,63.5
N$19
  Top 0.406: R13.1 40.64,120.65 40.64,121.92 R10.2
  Bottom 0.406: 45.72,118.11 Q1.2 | Q2.3 45.72,118.11 | 45.72,118.11 R13.1
N$26  (via drill 0.81)
  Top 0.406: E7.10 E4.4 68.58,31.75 76.2,31.75 80.01,35.56 82.55,35.56 R1.1 | E9.10 64.77,62.23 66.04,60.96 68.58,60.96 69.85,62.23 | 69.85,62.23 E9.12 | v81.28,59.69 72.39,59.69 69.85,62.23 | E16.13 74.93,120.65 80.01,120.65 82.55,119.38 92.71,104.14 113.03,104.14 115.57,101.6 115.57,99.06 v111.76,95.25 | v87.63,39.37 82.55,44.45 v82.55,46.99
  Bottom 0.406: v87.63,39.37 96.52,48.26 96.52,63.5 101.6,68.58 107.95,68.58 109.22,69.85 109.22,74.93 114.3,77.47 116.84,80.01 116.84,91.44 v111.76,95.25 | E1.4 E1.10 38.1,3.81 48.26,3.81 50.8,8.89 54.61,8.89 55.88,7.62 55.88,5.08 58.42,2.54 74.93,2.54 77.47,5.08 | 77.47,5.08 77.47,12.7 74.93,15.24 68.58,15.24 E2.4 E2.10 | E4.4 E4.10 | E7.10 E7.4 | 69.85,121.92 E16.4 | 69.85,121.92 E16.2 | E16.13 69.85,121.92 | 77.47,5.08 85.09,5.08 87.63,7.62 R1.1 85.09,31.75 83.82,40.64 83.82,44.45 v82.55,46.99 83.82,49.53 83.82,54.61 v81.28,59.69
N$36
  Top 0.406: R12.1 29.21,121.92 29.21,125.73 30.48,127 44.45,127 46.99,124.46 Q1.1
  Bottom 0.406: Q1.1 49.53,121.92 52.07,119.38 Q2.1
N$38
  Top 0.406: C26.1 35.56,115.57 | 35.56,115.57 Q2.2 | R11.2 35.56,119.38 35.56,115.57
N$40
  Bottom 0.406: C23.- 107.95,111.76 109.22,110.49 109.22,106.68 E15.11
N$41  (via drill 0.81)
  Top 0.406: E13.5 E13.4 | v24.13,95.25 54.61,95.25 E14.8
  Bottom 0.406: E13.5 36.83,105.41 25.4,100.33 v24.13,95.25 | E13.4 39.37,105.41 40.64,104.14 43.18,104.14 44.45,105.41 E13.2
N$49
  Bottom 0.406: E10.11 97.79,73.66 91.44,74.93 90.17,78.74 90.17,80.01 93.98,80.01 96.52,82.55 C22.-
N$53  (via drill 0.81)
  Top 0.406: E13.1 48.26,107.95 55.88,107.95 v59.69,111.76
  Bottom 0.406: v59.69,111.76 E16.9
N$54
  Top 0.406: E14.3 66.04,113.03 E16.12
N$56  (via drill 0.81)
  Top 0.406: v101.6,43.18 C24.- C25.-
  Bottom 0.406: E5.11 100.33,33.02 101.6,34.29 109.22,38.1 109.22,40.64 106.68,43.18 v101.6,43.18
N$57
  Bottom 0.406: E5.13 105.41,34.29 109.22,36.83 110.49,38.1 110.49,43.18 109.22,44.45 109.22,53.34 114.3,55.88 115.57,57.15 115.57,59.69 D3.C
N$58
  Top 0.406: C24.+ C25.+
  Bottom 0.406: 109.22,64.77 D3.A | C25.+ 109.22,64.77 | 109.22,64.77 R8.1
N$59
  Bottom 0.406: E15.13 106.68,102.87 110.49,105.41 110.49,114.3 111.76,115.57 113.03,115.57 114.3,116.84 114.3,121.92 D2.C
N$60
  Top 0.406: R6.1 D2.A R7.1
  Bottom 0.406: D2.A C23.+
N$61
  Top 0.406: E16.3 72.39,128.27 77.47,128.27 95.25,113.03 E15.6
N$63
  Bottom 0.406: E10.13 106.68,73.66 109.22,76.2 109.22,81.28 110.49,82.55 114.3,82.55 115.57,85.09 115.57,88.9 D1.C
N$64
  Top 0.406: D1.A R3.1 97.79,91.44 86.36,91.44 R4.A
  Bottom 0.406: D1.A C22.+
PB0
  Top 0.406: U$2.AK1 8.89,29.21 13.97,29.21 21.59,36.83 40.64,36.83 41.91,35.56 E3.4
PB1
  Top 0.406: E3.2 44.45,34.29 40.64,38.1 20.32,38.1 15.24,33.02 8.89,33.02 U$2.AL1
PB2
  Top 0.406: U$2.AM1 8.89,35.56 15.24,35.56 20.32,40.64 34.29,40.64 E6.10
PB3
  Top 0.406: U$2.AN1 8.89,39.37 16.51,39.37 19.05,41.91 30.48,41.91 E6.8
PB4
  Bottom 0.406: U$2.AK2 8.89,29.21 21.59,29.21 26.67,25.4 E3.8
PB5
  Bottom 0.406: U$2.AL2 8.89,33.02 21.59,33.02 30.48,27.94 34.29,27.94 E3.10
PB6
  Bottom 0.406: U$2.AM2 8.89,35.56 21.59,35.56 30.48,30.48 38.1,30.48 E3.12
PB7
  Bottom 0.406: U$2.AN2 8.89,39.37 15.24,39.37 19.05,38.1 29.21,38.1 E3.6
PUN_DONE
  Top 0.406: R2.1 82.55,82.55 77.47,87.63 E12.1 73.66,86.36 68.58,86.36 E12.4
  Bottom 0.406: U$2.BH2 8.89,92.71 15.24,92.71 19.05,91.44 25.4,91.44 27.94,93.98 41.91,93.98 43.18,95.25 62.23,95.25 E12.4
PUN_FLAG  (via drill 0.81)
  Top 0.406: E12.8 E12.9 62.23,77.47 | E12.11 64.77,77.47 62.23,77.47 | v60.96,74.93 62.23,77.47
  Bottom 0.406: E9.9 57.15,69.85 57.15,71.12 v60.96,74.93
SYNC_BIAS
  Bottom 0.406: U$2.BU2 8.89,124.46 13.97,124.46 16.51,125.73 24.13,125.73 26.67,128.27 33.02,128.27 36.83,125.73 36.83,120.65 41.91,114.3 R14.1
SYNC_PUN  (via drill 0.81)
  Top 0.406: v21.59,55.88 v30.48,58.42 | v44.45,54.61 81.28,54.61 85.09,50.8 85.09,45.72 87.63,43.18 88.9,43.18 90.17,41.91 90.17,38.1 92.71,35.56 104.14,35.56 105.41,36.83 107.95,36.83 110.49,38.1 113.03,38.1 116.84,41.91 116.84,80.01 118.11,82.55 118.11,105.41 115.57,107.95 115.57,125.73 111.76,129.54 55.88,129.54 v52.07,125.73
  Bottom 0.406: U$2.AV2 8.89,58.42 13.97,58.42 v21.59,55.88 | R11.1 41.91,121.92 40.64,123.19 40.64,125.73 41.91,127 50.8,127 v52.07,125.73 | v30.48,58.42 40.64,58.42 v44.45,54.61
SYNC_PUN0
  Top 0.406: U$2.BV1 8.89,128.27 13.97,128.27 R9.2 25.4,128.27 45.72,128.27 Q1.3 52.07,118.11 54.61,115.57 64.77,115.57 E16.11
VCC  (via drill 0.81)
  Top 0.813: 107.95,27.94 C18.+ C19.+ C20.+ C21.+ 110.49,5.08 82.55,5.08 C2.1 E2.14 72.39,2.54 55.88,2.54 C1.1 E1.14 | 107.95,27.94 R1.2 | 107.95,27.94 E5.14 C6.1 C5.1 | C8.1 E7.14 72.39,45.72 53.34,45.72 C7.1 | R13.2 22.86,118.11 R12.2 | C15.1 E14.14 71.12,101.6 53.34,101.6 C14.1 E13.14 44.45,101.6 27.94,101.6 v25.4,102.87 | C17.1 E16.14 | E10.14 C11.1 | C9.1 E9.14 72.39,66.04 55.88,66.04 C10.1 E8.14 | C4.1 E4.14 72.39,27.94 C3.1 | v54.61,80.01 57.15,82.55 72.39,82.55 E12.14 C13.1 87.63,73.66 105.41,73.66 E10.14 | C16.1 E15.14 106.68,96.52 | 106.68,96.52 105.41,91.44 R2.2 | R3.2 92.71,96.52 106.68,96.52 | 105.41,118.11 R5.2 | 105.41,118.11 R7.2 | v114.3,111.76 105.41,118.11 | 106.68,66.04 R8.2 | 106.68,66.04 E10.14 | v113.03,44.45 111.76,44.45 106.68,49.53 106.68,66.04
  Bottom 0.813: U$2.AA2 8.26,3.81 19.05,3.81 20.32,2.54 50.8,2.54 52.07,3.81 C1.1 | C3.1 E3.14 | C7.1 E6.14 | U$2.BA2 8.89,73.66 20.32,73.66 C12.1 44.45,77.47 E11.14 v54.61,80.01 | R12.2 20.32,114.3 25.4,109.22 v25.4,102.87 | R13.2 R14.2 | C8.1 82.55,33.02 82.55,27.94 | 82.55,27.94 C4.1 | C2.1 81.28,6.35 83.82,6.35 86.36,8.89 86.36,12.7 82.55,16.51 82.55,27.94 | C13.1 80.01,73.66 81.28,72.39 81.28,67.31 C9.1 | R3.2 C15.1 | C17.1 88.9,118.11 97.79,113.03 R5.2 | C6.1 C5.1 115.57,38.1 115.57,41.91 v113.03,44.45 | R8.2 R15.2 | C11.1 118.11,78.74 118.11,93.98 C16.1 116.84,104.14 116.84,110.49 v114.3,111.76

### Text on the board
Bottom: PUNCH CONTROL M710H
tNames: V1 | V1 | V1 | V1 | V1 | V1 | V1 | V1 | V1 | V1 | V1 | V1 | V1 | V1 | V1 | V1 | V1 | V1 | V1 | V1 | V1 | V1 | V1 | V1 | V1 | V1 | V1 | V1 | V1 | V1 | V1 | V1 | A1 | A1 | A1 | A1 | A1 | A1 | A1 | A1 | A1 | A1 | A1 | A1 | A1 | A1 | A1 | A1 | A1 | A1 | A1 | A1 | A1 | A1 | A1 | A1 | A1 | A1 | A1 | A1 | A1 | A1 | A1 | A1